# Altium schematic sheet Cell-Protection.SchDoc
size A; SheetNumber: 2; SheetTotal: 13
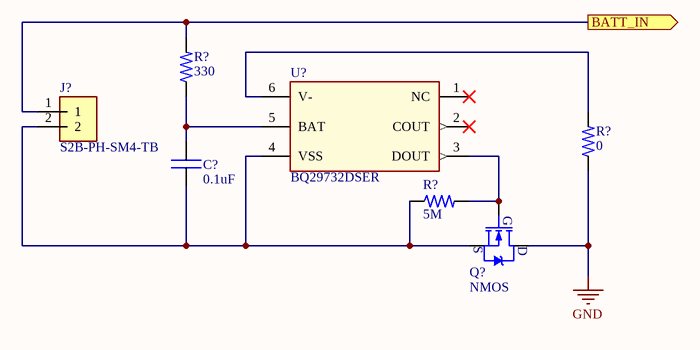
[diagram p0: Cell-Protection.SchDoc]

## Parts
(Parts that share a designator on the sheet are numbered #1, #2 ... from top to bottom, then left to right.)
C?  value 0.1uF  [0402C]  (hidden comment: CAP)
J?  S2B-PH-SM4-TB  [JST_PH-2POS-SMT-RA]
Q?  NMOS  [TSOT-23-6_POWER]
R?#1  value 330  [0402R]  (hidden comment: RES)
R?#2  value 0  [0402R]  (hidden comment: RES)
R?#3  value 5M  [0402R]  (hidden comment: RES)
U?  BQ29732DSER  [6-WFDFN]

## Ports
BATT_IN (out)

## Nets
GND: Q?.D R?#2.1
BATT_IN: J?.1 R?#1.2 ; port BATT_IN
NetC?_1: C?.1 J?.2 Q?.S R?#3.1 U?.4(VSS)
NetC?_2: C?.2 R?#1.1 U?.5(BAT)
NetQ?_G: Q?.G R?#3.2 U?.3(DOUT)
NetR?#2_2: R?#2.2 U?.6(V-)

Not connected (* = marked no-connect by the designer): U? 1(NC)* 2(COUT)*

## Library data of the parts
C? = CAP: Capacitor; MFR: *; MFR PN: *; JLCPCB PN: *; Footprint: *
J? = JST CONN 2POS PH: Connector Header Surface Mount, Right Angle 2 position 0.079 (2.00mm); MFR PN: S2B-PH-SM4-TB(TF)(SN); MFR: JST Sales; Value: S2B-PH-SM4-TB(TF)(SN); Type: SMD
Q? = NMOS_POWER: N-Channel MOSFET; MFR: Diodes Incorporated; Value: DMN4060SVT-7; Type: SMD; MFR PN: DMN4060SVT-7; JLCPCB PN: C155314
R?#1-R?#3 = RES: Resistor; MFR PN: *; MFR: *; JLCPCB PN: *
U? = BATT PROTECTION: IC BATT PROT LI-ION 1CELL 6WSON; MFR: Texas Instruments; MFR PN: BQ29732DSER; Value: BQ29732DSER; JLCPCB PN: *